# EAGLE schematic Detector (EAGLE 6.4)

## Sheet 1 of 6
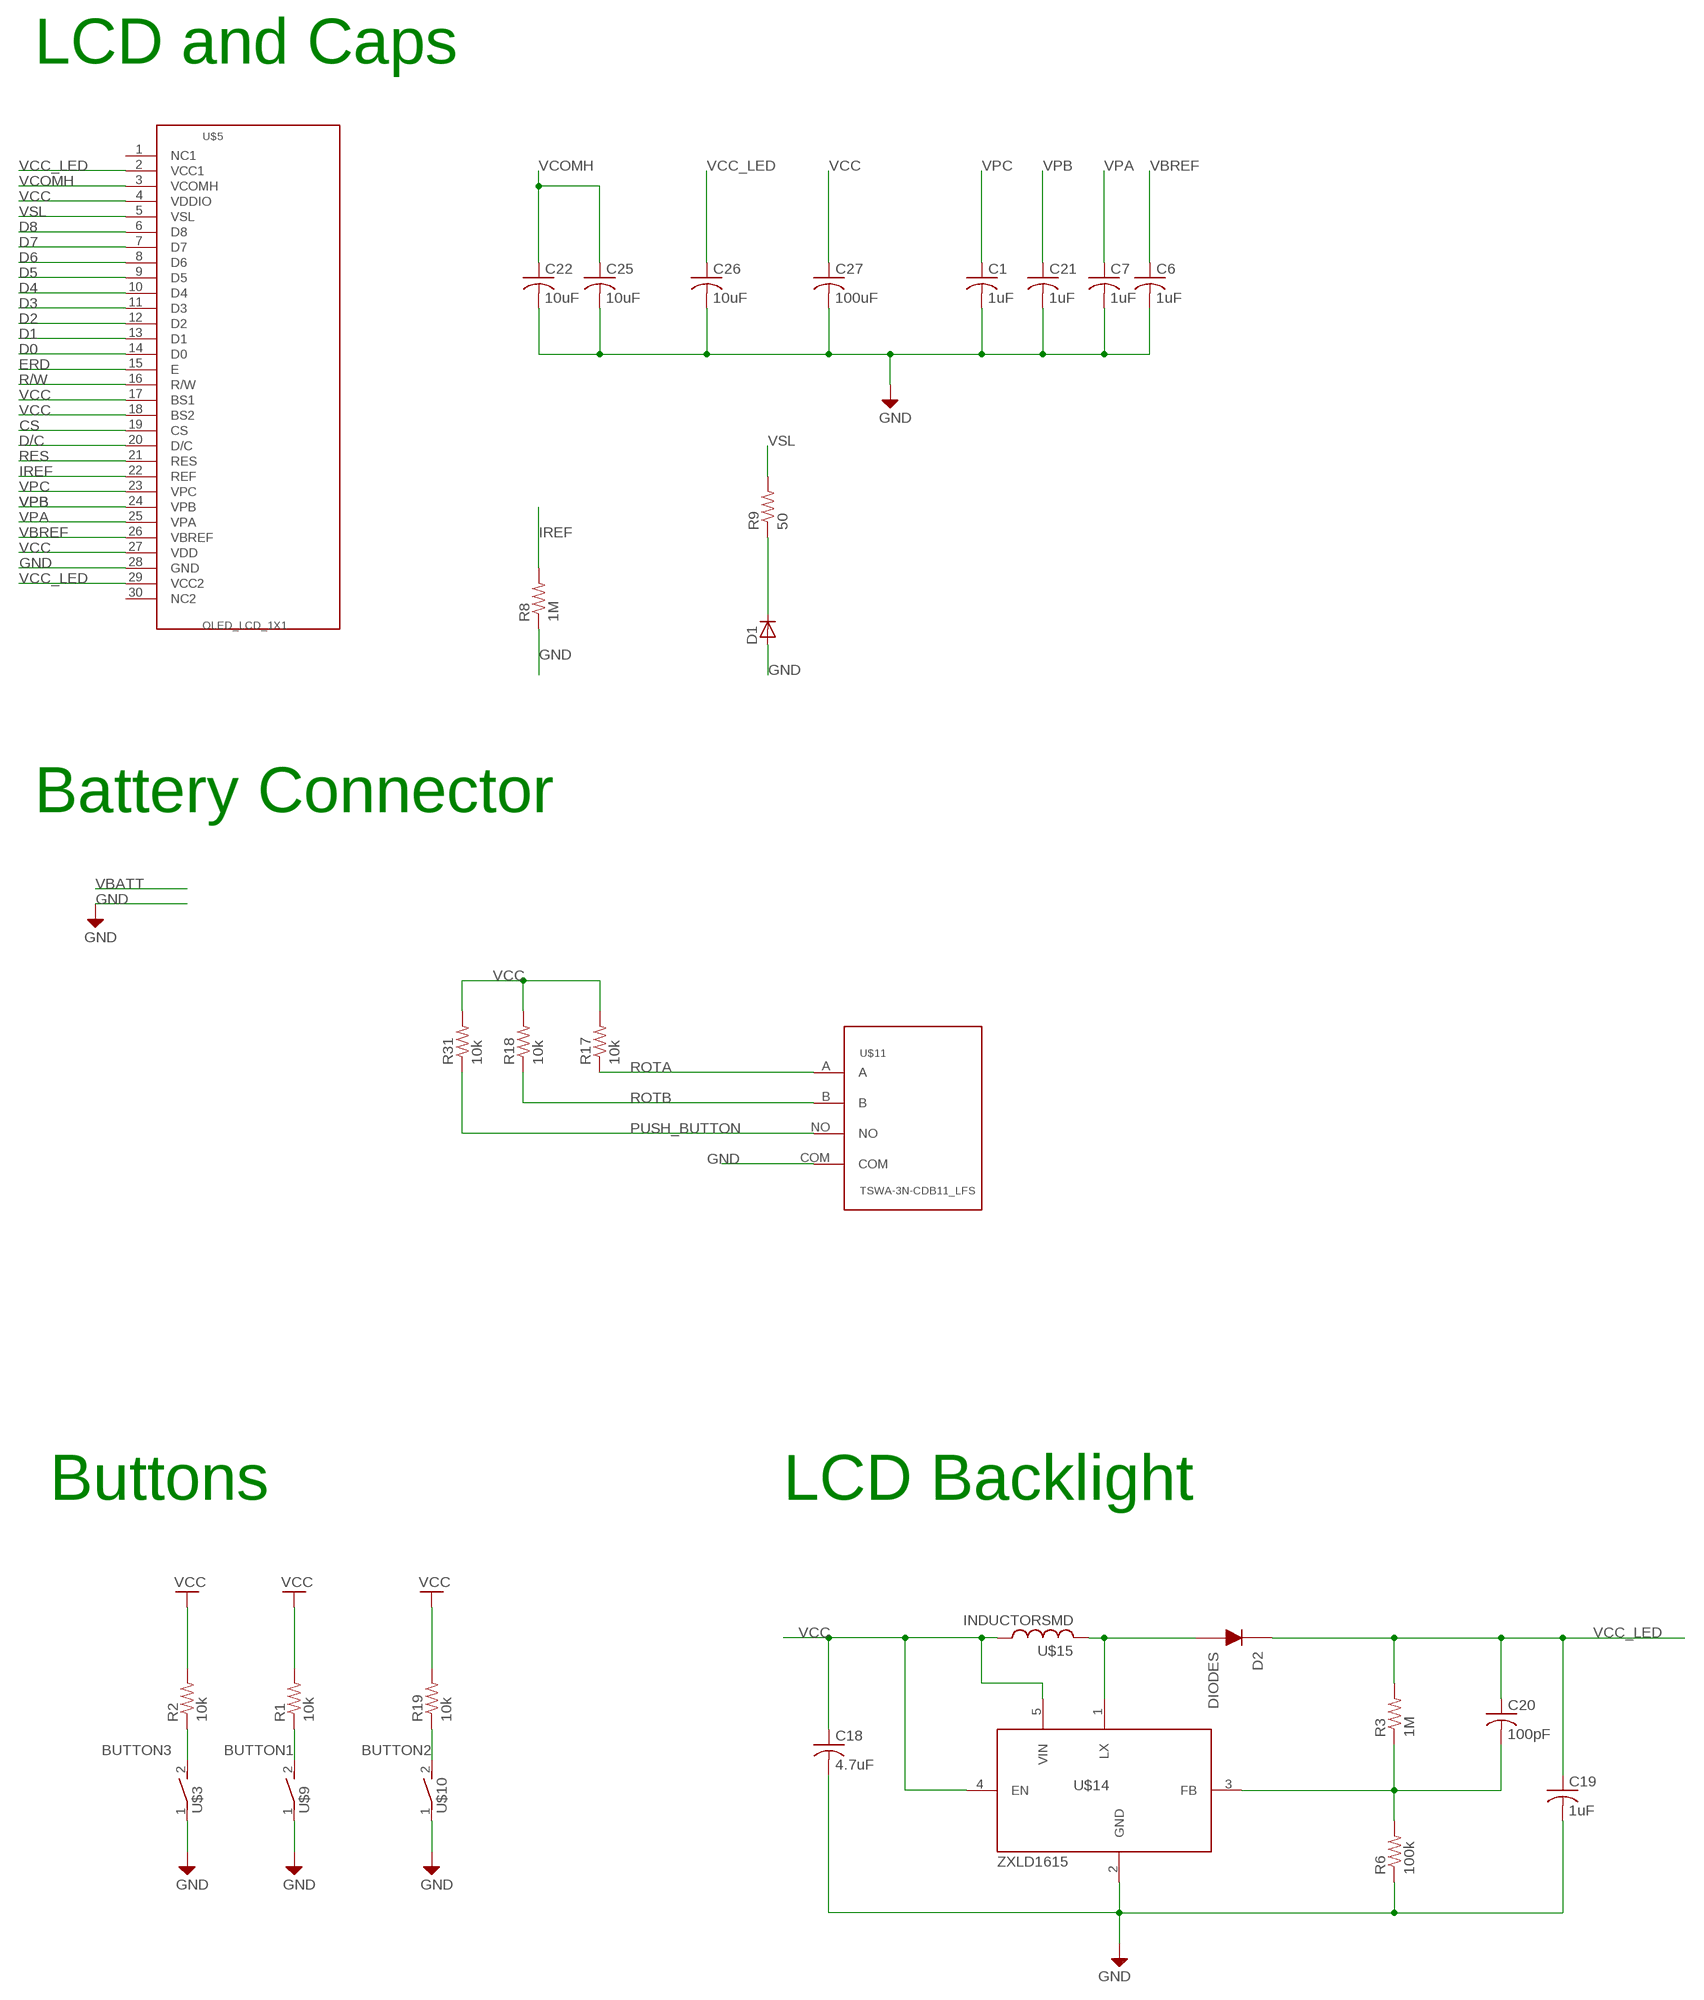
[diagram p0: schematic, sheet 1, part 1 of 2]
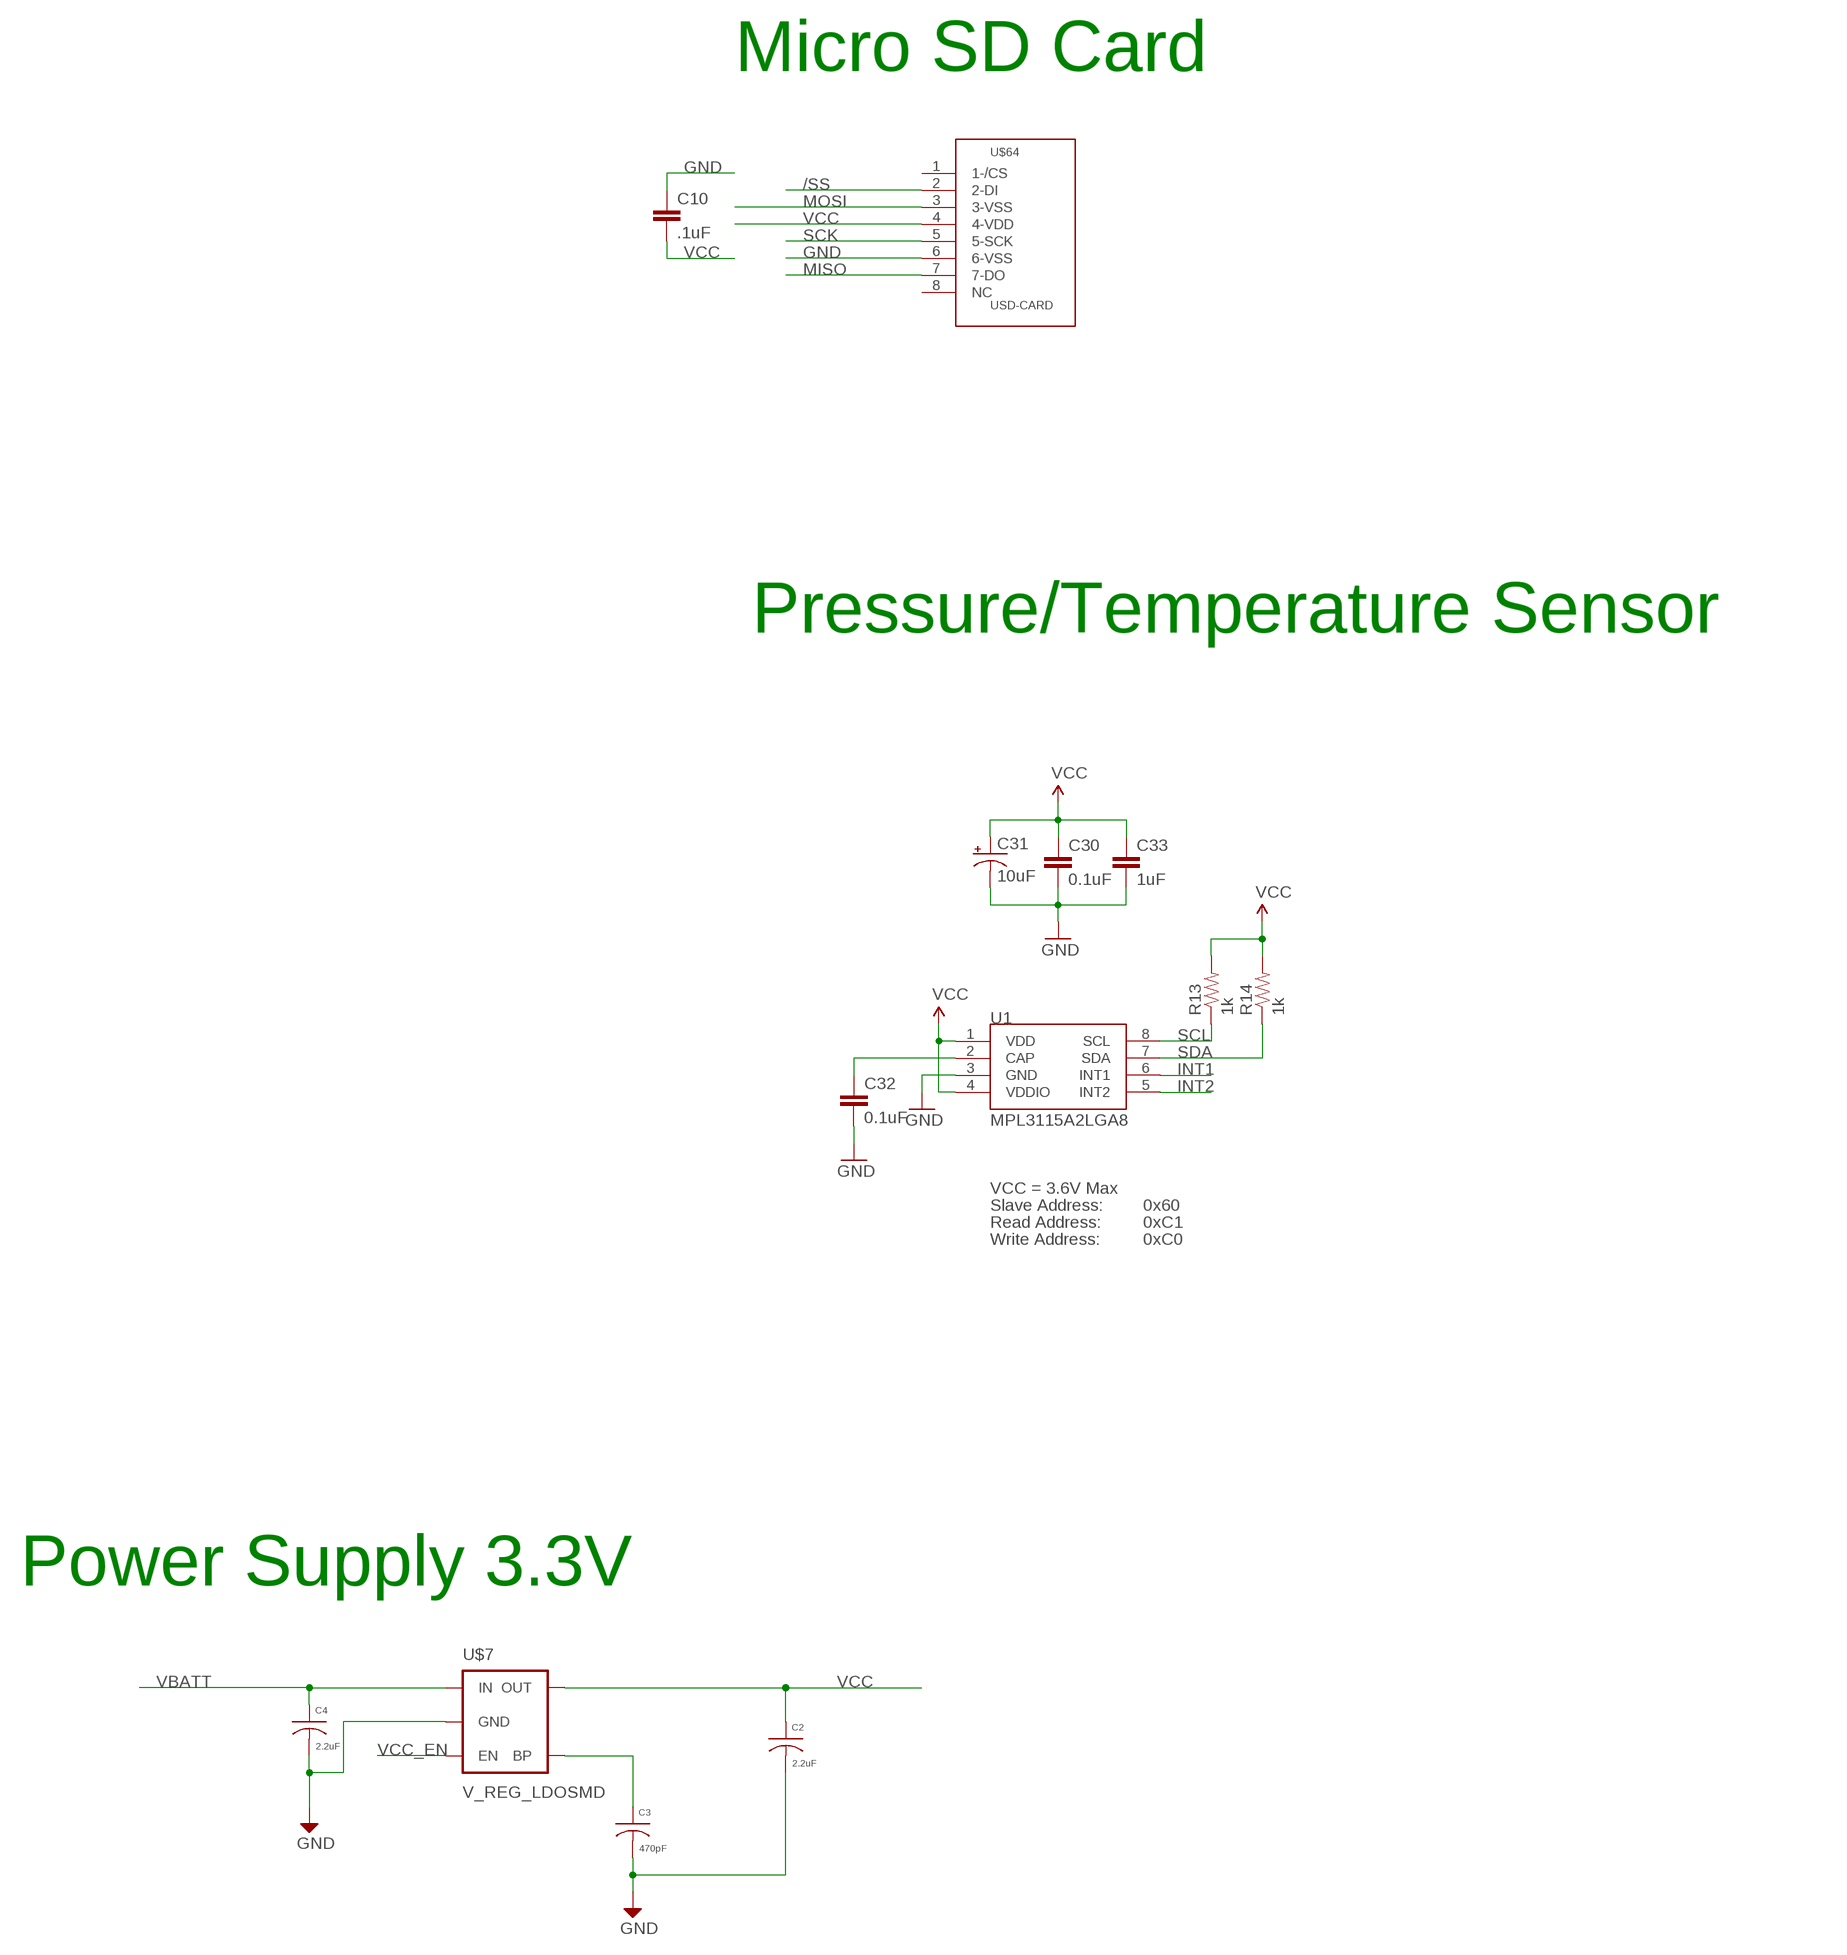
[diagram p1: schematic, sheet 1, part 2 of 2]

### Parts
C1  1uF  C-USC0603  [C0603]
C2  2.2uF  C0603  [C0603]
C3  470pF  C0603  [C0603]
C4  2.2uF  C0603  [C0603]
C6  1uF  C-USC0603  [C0603]
C7  1uF  C-USC0603  [C0603]
C10  .1uF  C-EUC0402  [C0402]
C18  4.7uF  C-USC0805K  [C0805K]
C19  1uF  C-USC1206  [C1206]
C20  100pF  C-USC0402  [C0402]
C21  1uF  C-USC0603  [C0603]
C22  10uF  C-USC0603  [C0603]
C25  10uF  C-USC0603  [C0603]
C26  10uF  C-USC0603  [C0603]
C27  100uF  C-USC0603  [C0603]
C30  0.1uF  CAP0402-CAP  [0402-CAP]
C31  10uF  CAP_POL1206  [EIA3216]
C32  0.1uF  CAP0402-CAP  [0402-CAP]
C33  1uF  CAP0402-CAP  [0402-CAP]
D1  D-SOD123  [SOD123]
D2  DIODES  [SOD-123]
R1  10k  R-US_R0603  [R0603]
R2  10k  R-US_R0603  [R0603]
R3  1M  R-US_R0805  [R0805]
R6  100k  R-US_R0805  [R0805]
R8  1M  R-US_R0603  [R0603]
R9  50  R-US_R0603  [R0603]
R13  1k  RESISTOR0402-RES  [0402-RES]
R14  1k  RESISTOR0402-RES  [0402-RES]
R17  10k  R-US_R0603  [R0603]
R18  10k  R-US_R0603  [R0603]
R19  10k  R-US_R0603  [R0603]
R31  10k  R-US_R0603  [R0603]
U1  MPL3115A2LGA8  [LGA8]
U$3  RGHT-ANGLE-SMT-SWITCH-688-SKRELF  [2.9X3.9X2.0]
U$5  OLED_LCD_1X1  [30ZIF]
U$7  V_REG_LDOSMD  [SOT23-5]
U$9  RGHT-ANGLE-SMT-SWITCH-688-SKRELF  [2.9X3.9X2.0]
U$10  RGHT-ANGLE-SMT-SWITCH-688-SKRELF  [2.9X3.9X2.0]
U$11  TSWA-3N-CDB11_LFS  [TSWA-3N-CB11_LFS]
U$14  ZXLD1615  [SOT23-5L]
U$15  INDUCTORSMD  [INDUCTORSMD1]
U$64  USD-CARD  [502774-0891]

### Nets
/SS: U$64.2(2-DI) ; also sheet 2
BUTTON1: R1.1 U$9.2 ; also sheet 2
BUTTON2: R19.1 U$10.2 ; also sheet 2
BUTTON3: R2.1 U$3.2 ; also sheet 2
CS: U$5.19(CS) ; also sheet 2
D0: U$5.14(D0) ; also sheet 2
D1: U$5.13(D1) ; also sheet 2
D2: U$5.12(D2) ; also sheet 2
D3: U$5.11(D3) ; also sheet 2
D4: U$5.10(D4) ; also sheet 2
D5: U$5.9(D5) ; also sheet 2
D6: U$5.8(D6) ; also sheet 2
D7: U$5.7(D7) ; also sheet 2
D8: U$5.6(D8) ; also sheet 2
D/C: U$5.20(D/C) ; also sheet 2
ERD: U$5.15(E) ; also sheet 2
GND: C1.2 C2.2 C3.2 C4.2 C6.2 C7.2 C10.1 C18.2 C19.2 C21.2 C22.2 C25.2 C26.2 C27.2 C30.2 C31.C(-) C32.2 C33.2 D1.2(A) R6.1 R8.1 U1.3(GND) U$3.1 U$5.28(GND) U$7.2(GND) U$9.1 U$10.1 U$11.COM U$14.2(GND) U$64.6(6-VSS) ; also sheet 2,3,4,5,6
INT1: U1.6(INT1)
INT2: U1.5(INT2)
IREF: R8.2 U$5.22(REF)
MISO: U$64.7(7-DO) ; also sheet 2
MOSI: U$64.3(3-VSS) ; also sheet 2
N$2: C3.1 U$7.4(BP)
N$3: C20.2 R3.1 R6.2 U$14.3(FB)
N$5: D1.1(C) R9.1 ; also sheet 2
N$9: D2.1(A1) U$14.1(LX) U$15.2
N$31: C32.1 U1.2(CAP)
PUSH_BUTTON: R31.1 U$11.NO ; also sheet 2
R/W: U$5.16(R/W) ; also sheet 2
RES: U$5.21(RES) ; also sheet 2
ROTA: R17.1 U$11.A ; also sheet 2
ROTB: R18.1 U$11.B ; also sheet 2
SCK: U$64.5(5-SCK) ; also sheet 2
SCL: R13.1 U1.8(SCL) ; also sheet 2,4,5
SDA: R14.1 U1.7(SDA) ; also sheet 2,4,5
VBATT: C4.1 U$7.1(IN) ; also sheet 6
VBREF: C6.1 U$5.26(VBREF)
VCC: C2.1 C10.2 C18.1 C27.1 C30.1 C31.A(+) C33.1 R1.2 R2.2 R13.2 R14.2 R17.2 R18.2 R19.2 R31.2 U1.1(VDD) U1.4(VDDIO) U$5.4(VDDIO) U$5.17(BS1) U$5.18(BS2) U$5.27(VDD) U$7.5(OUT) U$14.4(EN) U$14.5(VIN) U$15.1 U$64.4(4-VDD) ; also sheet 2,3,5
VCC_EN: U$7.3(EN)
VCC_LED: C19.1 C20.1 C26.1 D2.2(C) R3.2 U$5.2(VCC1) U$5.29(VCC2)
VCOMH: C22.1 C25.1 U$5.3(VCOMH)
VPA: C7.1 U$5.25(VPA)
VPB: C21.1 U$5.24(VPB)
VPC: C1.1 U$5.23(VPC)
VSL: R9.2 U$5.5(VSL)
Unconnected: U$5.1(NC1) U$5.30(NC2) U$64.1(1-/CS) U$64.8(NC)

### Notes on the sheet
- LCD and Caps
- Micro SD Card
- Pressure/Temperature Sensor
- Battery Connector
- VCC = 3.6V Max
- Slave Address: | 0x60
- Read Address: | 0xC1
- Write Address: | 0xC0
- Buttons | LCD Backlight | Power Supply 3.3V

## Sheet 2 of 6
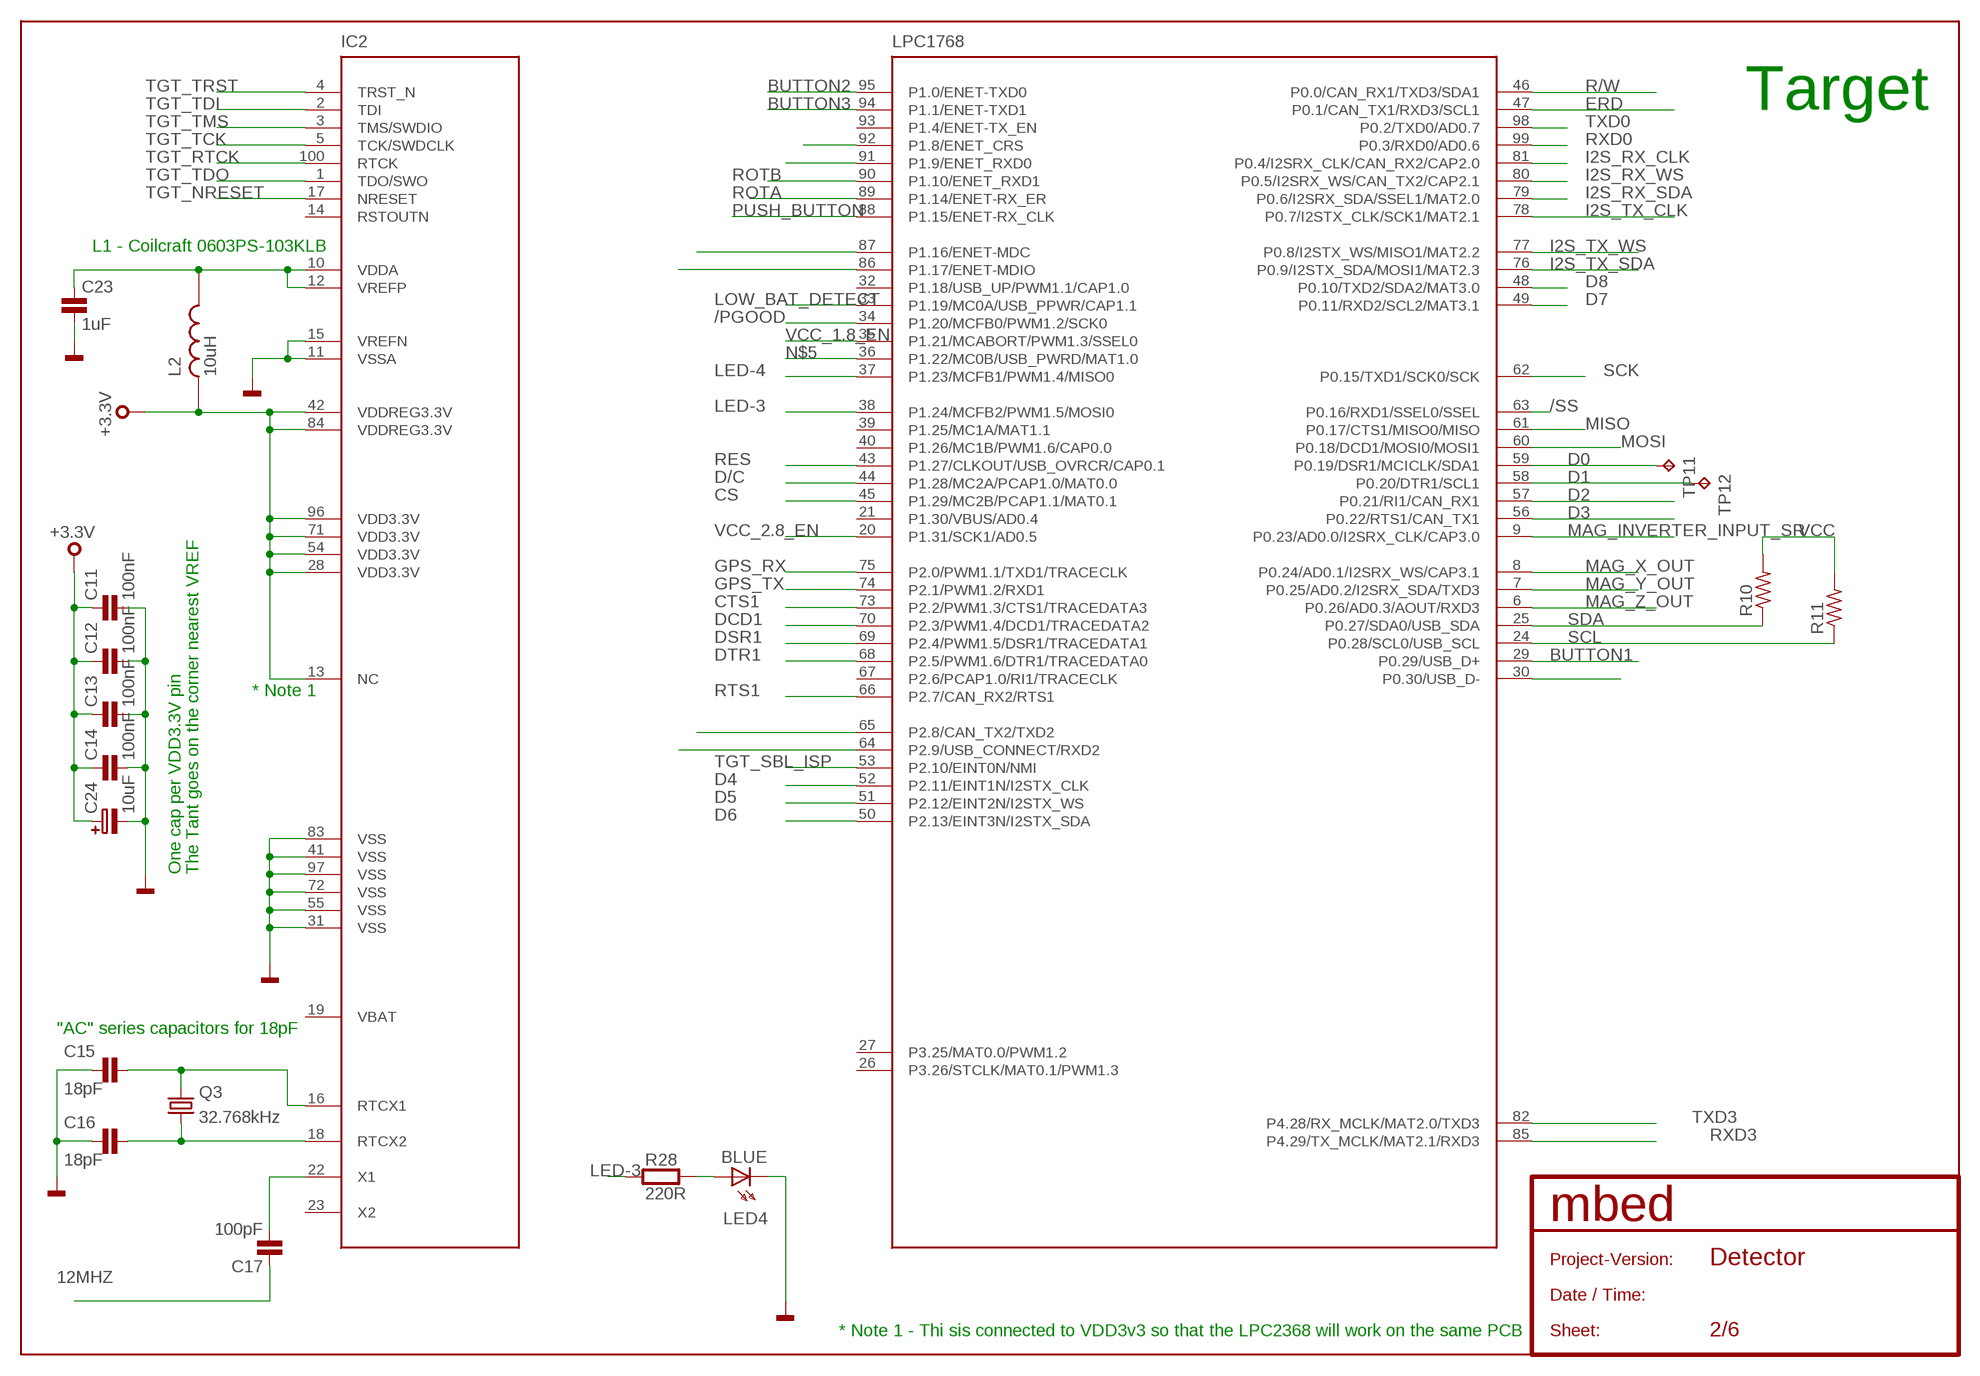
[diagram p2: schematic, sheet 2]

### Parts
C11  100nF  C0402  [0402]
C12  100nF  C0402  [0402]
C13  100nF  C0402  [0402]
C14  100nF  C0402  [0402]
C15  18pF  C0402  [0402]
C16  18pF  C0402  [0402]
C17  100pF  C0402  [0402]
C23  1uF  C0805  [0805]
C24  10uF  C-POLARISEDSMT_TANTALUM  [C106B]
IC2  LPC1768  [LQFP100]
L2  10uH  L_L  [L0603]
LED4  BLUE  LED_0805  [LED_0805]
Q3  32.768kHz  CRYSTALFC135  [FC135]
R10  R-US_R0402  [R0402]
R11  R-US_R0402  [R0402]
R28  220R  R0402  [0402]
TP11  TPTP06R  [TP06R]
TP12  TPTP06R  [TP06R]

### Nets
12MHZ: C17.1 ; also sheet 3
/PGOOD: IC2.34(P1.20/MCFB0/PWM1.2/SCK0)
/SS: IC2.63(P0.16/RXD1/SSEL0/SSEL) ; also sheet 1
BUTTON1: IC2.29(P0.29/USB_D+) ; also sheet 1
BUTTON2: IC2.95(P1.0/ENET-TXD0) ; also sheet 1
BUTTON3: IC2.94(P1.1/ENET-TXD1) ; also sheet 1
CS: IC2.45(P1.29/MC2B/PCAP1.1/MAT0.1) ; also sheet 1
CTS1: IC2.73(P2.2/PWM1.3/CTS1/TRACEDATA3)
D0: IC2.59(P0.19/DSR1/MCICLK/SDA1) TP11.TP ; also sheet 1
D1: IC2.58(P0.20/DTR1/SCL1) TP12.TP ; also sheet 1
D2: IC2.57(P0.21/RI1/CAN_RX1) ; also sheet 1
D3: IC2.56(P0.22/RTS1/CAN_TX1) ; also sheet 1
D4: IC2.52(P2.11/EINT1N/I2STX_CLK) ; also sheet 1
D5: IC2.51(P2.12/EINT2N/I2STX_WS) ; also sheet 1
D6: IC2.50(P2.13/EINT3N/I2STX_SDA) ; also sheet 1
D7: IC2.49(P0.11/RXD2/SCL2/MAT3.1) ; also sheet 1
D8: IC2.48(P0.10/TXD2/SDA2/MAT3.0) ; also sheet 1
D/C: IC2.44(P1.28/MC2A/PCAP1.0/MAT0.0) ; also sheet 1
DCD1: IC2.70(P2.3/PWM1.4/DCD1/TRACEDATA2)
DSR1: IC2.69(P2.4/PWM1.5/DSR1/TRACEDATA1)
DTR1: IC2.68(P2.5/PWM1.6/DTR1/TRACEDATA0)
ERD: IC2.47(P0.1/CAN_TX1/RXD3/SCL1) ; also sheet 1
GND: C11.2 C12.2 C13.2 C14.2 C15.1 C16.1 C23.2 C24.2 IC2.11(VSSA) IC2.15(VREFN) IC2.31(VSS) IC2.41(VSS) IC2.55(VSS) IC2.72(VSS) IC2.83(VSS) IC2.97(VSS) LED4.K ; also sheet 1,3,4,5,6
GPS_RX: IC2.75(P2.0/PWM1.1/TXD1/TRACECLK)
GPS_TX: IC2.74(P2.1/PWM1.2/RXD1)
I2S_RX_CLK: IC2.81(P0.4/I2SRX_CLK/CAN_RX2/CAP2.0) ; also sheet 4
I2S_RX_SDA: IC2.79(P0.6/I2SRX_SDA/SSEL1/MAT2.0) ; also sheet 4
I2S_RX_WS: IC2.80(P0.5/I2SRX_WS/CAN_TX2/CAP2.1) ; also sheet 4
I2S_TX_CLK: IC2.78(P0.7/I2STX_CLK/SCK1/MAT2.1) ; also sheet 4
I2S_TX_SDA: IC2.76(P0.9/I2STX_SDA/MOSI1/MAT2.3) ; also sheet 4
I2S_TX_WS: IC2.77(P0.8/I2STX_WS/MISO1/MAT2.2)
IC6_RTC1: C15.2 IC2.16(RTCX1) Q3.X2
IC6_RTC2: C16.2 IC2.18(RTCX2) Q3.X1
IC6_XTAL1: C17.2 IC2.22(X1)
LED-3: IC2.38(P1.24/MCFB2/PWM1.5/MOSI0) R28.1
LED-4: IC2.37(P1.23/MCFB1/PWM1.4/MISO0)
LOW_BAT_DETECT: IC2.33(P1.19/MC0A/USB_PPWR/CAP1.1)
MAG_INVERTER_INPUT_SR: IC2.9(P0.23/AD0.0/I2SRX_CLK/CAP3.0)
MAG_X_OUT: IC2.8(P0.24/AD0.1/I2SRX_WS/CAP3.1) ; also sheet 5
MAG_Y_OUT: IC2.7(P0.25/AD0.2/I2SRX_SDA/TXD3) ; also sheet 5
MAG_Z_OUT: IC2.6(P0.26/AD0.3/AOUT/RXD3) ; also sheet 5
MISO: IC2.61(P0.17/CTS1/MISO0/MISO) ; also sheet 1
MOSI: IC2.60(P0.18/DCD1/MOSI0/MOSI1) ; also sheet 1
N$4: IC2.30(P0.30/USB_D-)
N$5: IC2.36(P1.22/MC0B/USB_PWRD/MAT1.0) ; also sheet 1
N$18: LED4.A R28.2
N$19: C23.1 IC2.10(VDDA) IC2.12(VREFP) L2.P$2
N$20: IC2.86(P1.17/ENET-MDIO)
N$21: IC2.87(P1.16/ENET-MDC)
N$25: IC2.91(P1.9/ENET_RXD0)
N$26: IC2.92(P1.8/ENET_CRS)
N$27: IC2.65(P2.8/CAN_TX2/TXD2)
N$28: IC2.64(P2.9/USB_CONNECT/RXD2)
PUSH_BUTTON: IC2.88(P1.15/ENET-RX_CLK) ; also sheet 1
R/W: IC2.46(P0.0/CAN_RX1/TXD3/SDA1) ; also sheet 1
RES: IC2.43(P1.27/CLKOUT/USB_OVRCR/CAP0.1) ; also sheet 1
ROTA: IC2.89(P1.14/ENET-RX_ER) ; also sheet 1
ROTB: IC2.90(P1.10/ENET_RXD1) ; also sheet 1
RTS1: IC2.66(P2.7/CAN_RX2/RTS1)
RXD0: IC2.99(P0.3/RXD0/AD0.6) ; also sheet 6
RXD3: IC2.85(P4.29/TX_MCLK/MAT2.1/RXD3)
SCK: IC2.62(P0.15/TXD1/SCK0/SCK) ; also sheet 1
SCL: IC2.24(P0.28/SCL0/USB_SCL) R11.1 ; also sheet 1,4,5
SDA: IC2.25(P0.27/SDA0/USB_SDA) R10.1 ; also sheet 1,4,5
TGT_NRESET: IC2.17(NRESET) ; also sheet 3
TGT_RTCK: IC2.100(RTCK)
TGT_SBL_ISP: IC2.53(P2.10/EINT0N/NMI) ; also sheet 3
TGT_TCK: IC2.5(TCK/SWDCLK)
TGT_TDI: IC2.2(TDI)
TGT_TDO: IC2.1(TDO/SWO)
TGT_TMS: IC2.3(TMS/SWDIO)
TGT_TRST: IC2.4(TRST_N)
TXD0: IC2.98(P0.2/TXD0/AD0.7) ; also sheet 6
TXD3: IC2.82(P4.28/RX_MCLK/MAT2.0/TXD3)
VCC: C11.1 C12.1 C13.1 C14.1 C24.1 IC2.13(NC) IC2.28(VDD3.3V) IC2.42(VDDREG3.3V) IC2.54(VDD3.3V) IC2.71(VDD3.3V) IC2.84(VDDREG3.3V) IC2.96(VDD3.3V) L2.P$1 R10.2 R11.2 ; supply symbol labelled +3.3V ; also sheet 1,3,5
VCC_1.8_EN: IC2.35(P1.21/MCABORT/PWM1.3/SSEL0)
VCC_2.8_EN: IC2.20(P1.31/SCK1/AD0.5)
Unconnected: IC2.14(RSTOUTN) IC2.19(VBAT) IC2.21(P1.30/VBUS/AD0.4) IC2.23(X2) IC2.26(P3.26/STCLK/MAT0.1/PWM1.3) IC2.27(P3.25/MAT0.0/PWM1.2) IC2.32(P1.18/USB_UP/PWM1.1/CAP1.0) IC2.39(P1.25/MC1A/MAT1.1) IC2.40(P1.26/MC1B/PWM1.6/CAP0.0) IC2.67(P2.6/PCAP1.0/RI1/TRACECLK) IC2.93(P1.4/ENET-TX_EN)

### Notes on the sheet
- Target
- L1 - Coilcraft 0603PS-103KLB
- * Note 1
- One cap per VDD3.3V pin | The Tant goes on the corner nearest VREF
- "AC" series capacitors for 18pF
- * Note 1 - Thi sis connected to VDD3v3 so that the LPC2368 will work on the same PCB

## Sheet 3 of 6
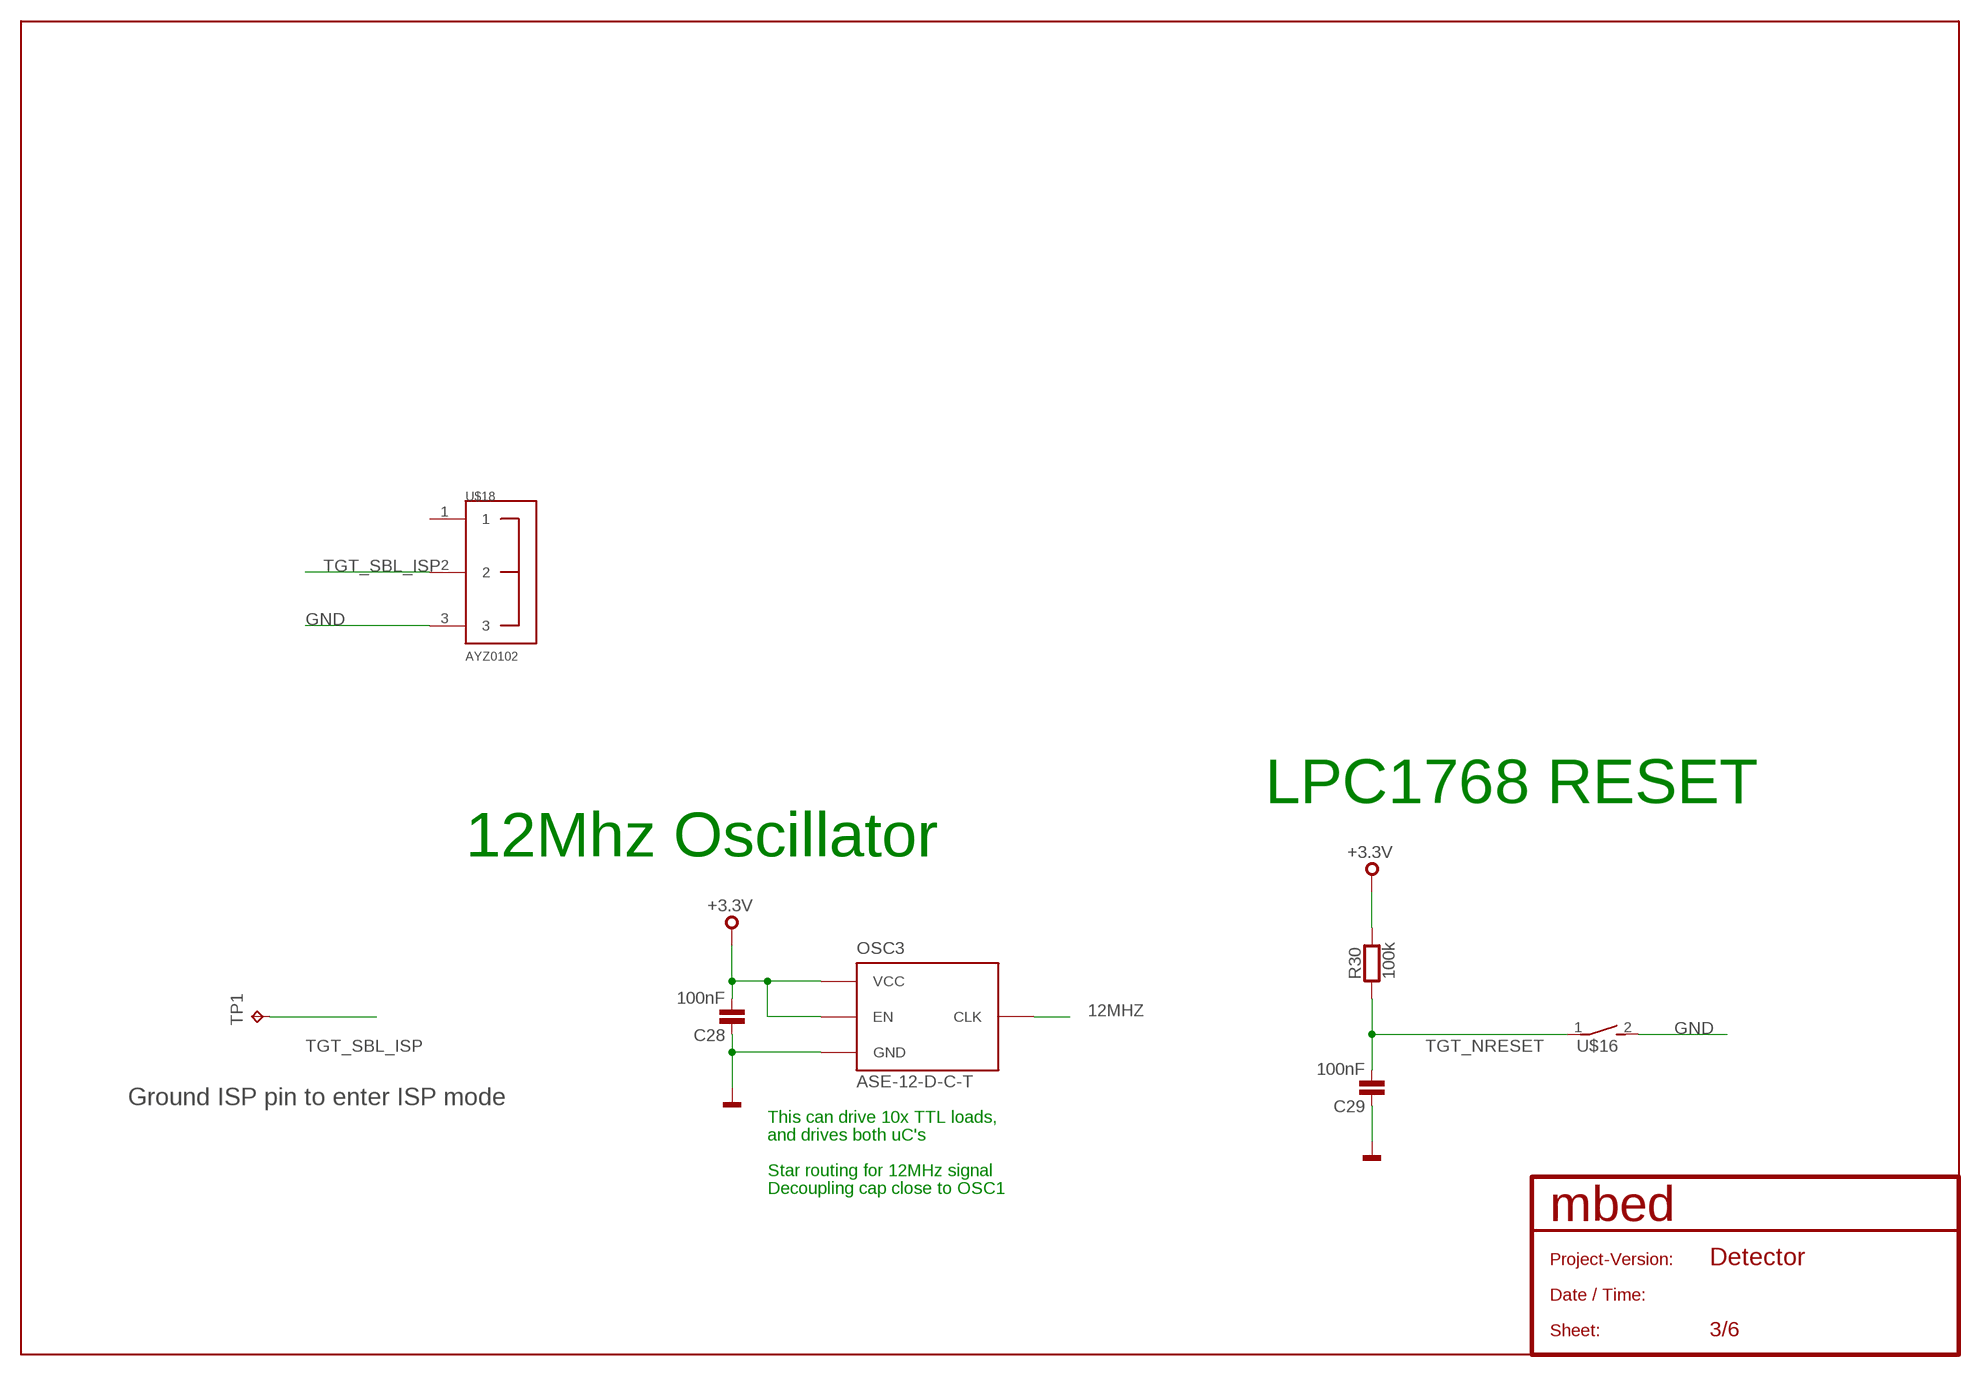
[diagram p3: schematic, sheet 3]

### Parts
C28  100nF  C0402  [0402]
C29  100nF  C0402  [0402]
OSC3  ASE-12-D-C-T  OSCILLATOR_2.5X3.2  [OSC3.2X.2.5]
R30  100k  R0402  [0402]
TP1  TPTP09R  [TP09R]
U$16  RGHT-ANGLE-SMT-SWITCH-688-SKRELF  [2.9X3.9X2.0]
U$18  AYZ0102  [AYZ0102]

### Nets
12MHZ: OSC3.P$3(CLK) ; also sheet 2
GND: C28.1 C29.1 OSC3.P$2(GND) U$16.2 U$18.3 ; also sheet 1,2,4,5,6
TGT_NRESET: C29.2 R30.1 U$16.1 ; also sheet 2
TGT_SBL_ISP: TP1.TP U$18.2 ; also sheet 2
VCC: C28.2 OSC3.P$1(EN) OSC3.P$4(VCC) R30.2 ; supply symbol labelled +3.3V ; also sheet 1,2,5
Unconnected: U$18.1

### Notes on the sheet
- LPC1768 RESET
- 12Mhz Oscillator
- Ground ISP pin to enter ISP mode
- This can drive 10x TTL loads,
- and drives both uC's
- Star routing for 12MHz signal
- Decoupling cap close to OSC1

## Sheet 4 of 6
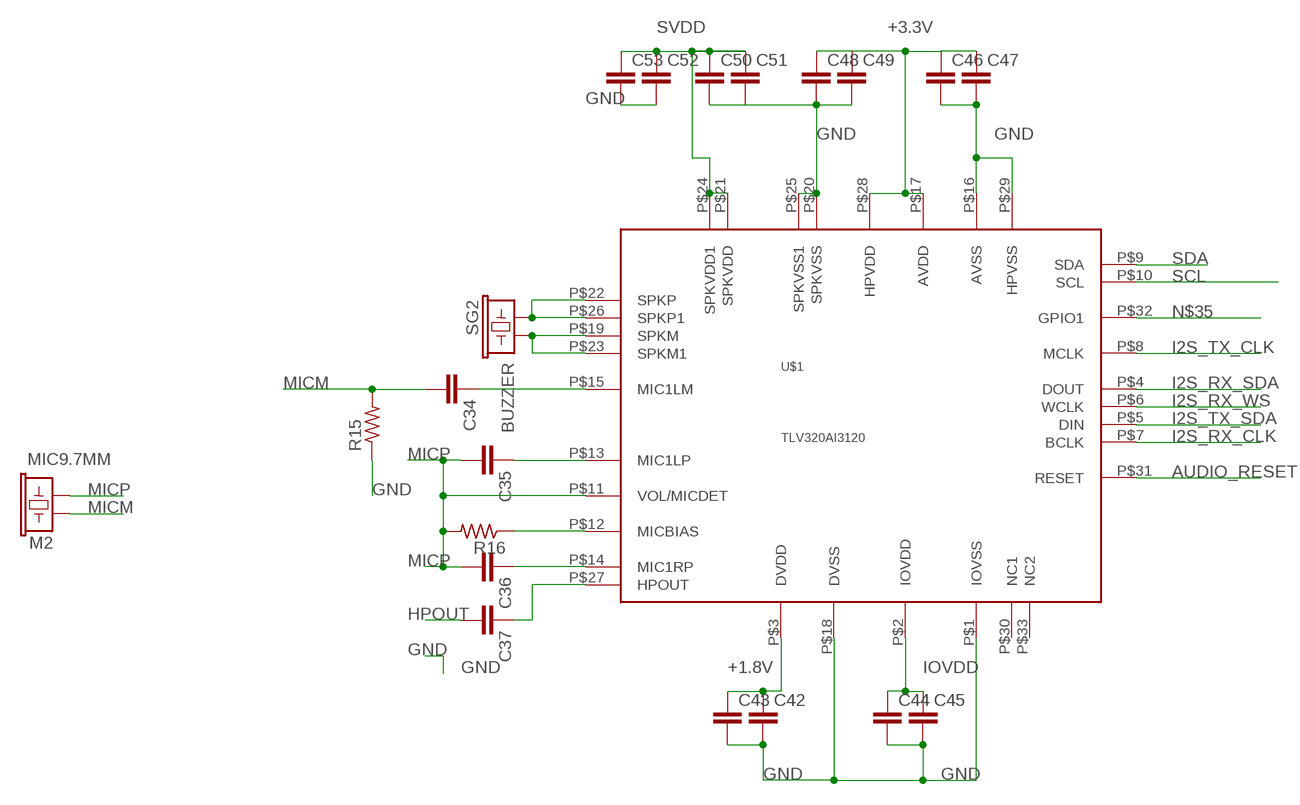
[diagram p4: schematic, sheet 4]

### Parts
C34  C-EUC0402  [C0402]
C35  C-EUC0402  [C0402]
C36  C-EUC0402  [C0402]
C37  C-EUC0402  [C0402]
C42  C-EUC0402  [C0402]
C43  C-EUC0402  [C0402]
C44  C-EUC0402  [C0402]
C45  C-EUC0402  [C0402]
C46  C-EUC0402  [C0402]
C47  C-EUC0402  [C0402]
C48  C-EUC0402  [C0402]
C49  C-EUC0402  [C0402]
C50  C-EUC0402  [C0402]
C51  C-EUC0402  [C0402]
C52  C-EUC0402  [C0402]
C53  C-EUC0402  [C0402]
M2  MIC9.7MM  [MIC-9.7MM]
R15  R-US_R0402  [R0402]
R16  R-US_R0402  [R0402]
SG2  BUZZER  [SMS-1308]
U$1  TLV320AI3120  [QFN-32]

### Nets
+1.8V: C42.1 C43.1 U$1.P$3(DVDD)
+3.3V: C46.1 C47.1 C48.1 C49.1 U$1.P$17(AVDD) U$1.P$28(HPVDD)
AUDIO_RESET: U$1.P$31(RESET)
GND: C42.2 C43.2 C44.2 C45.2 C46.2 C47.2 C48.2 C49.2 C50.2 C51.2 C52.2 C53.2 R15.1 U$1.P$1(IOVSS) U$1.P$16(AVSS) U$1.P$18(DVSS) U$1.P$20(SPKVSS) U$1.P$25(SPKVSS1) U$1.P$29(HPVSS) ; also sheet 1,2,3,5,6
HPOUT: C37.2
I2S_RX_CLK: U$1.P$7(BCLK) ; also sheet 2
I2S_RX_SDA: U$1.P$4(DOUT) ; also sheet 2
I2S_RX_WS: U$1.P$6(WCLK) ; also sheet 2
I2S_TX_CLK: U$1.P$8(MCLK) ; also sheet 2
I2S_TX_SDA: U$1.P$5(DIN) ; also sheet 2
IOVDD: C44.1 C45.1 U$1.P$2(IOVDD)
MICM: C34.2 M2.2 R15.2
MICP: C35.2 C36.2 M2.1 R16.2 U$1.P$11(VOL/MICDET)
N$12: SG2.+ U$1.P$22(SPKP) U$1.P$26(SPKP1)
N$17: SG2.- U$1.P$19(SPKM) U$1.P$23(SPKM1)
N$32: C34.1 U$1.P$15(MIC1LM)
N$35: U$1.P$32(GPIO1)
N$36: R16.1 U$1.P$12(MICBIAS)
N$37: C35.1 U$1.P$13(MIC1LP)
N$38: C36.1 U$1.P$14(MIC1RP)
N$39: C37.1 U$1.P$27(HPOUT)
SCL: U$1.P$10(SCL) ; also sheet 1,2,5
SDA: U$1.P$9(SDA) ; also sheet 1,2,5
SVDD: C50.1 C51.1 C52.1 C53.1 U$1.P$21(SPKVDD) U$1.P$24(SPKVDD1)
Unconnected: U$1.P$30(NC1) U$1.P$33(NC2)

## Sheet 5 of 6
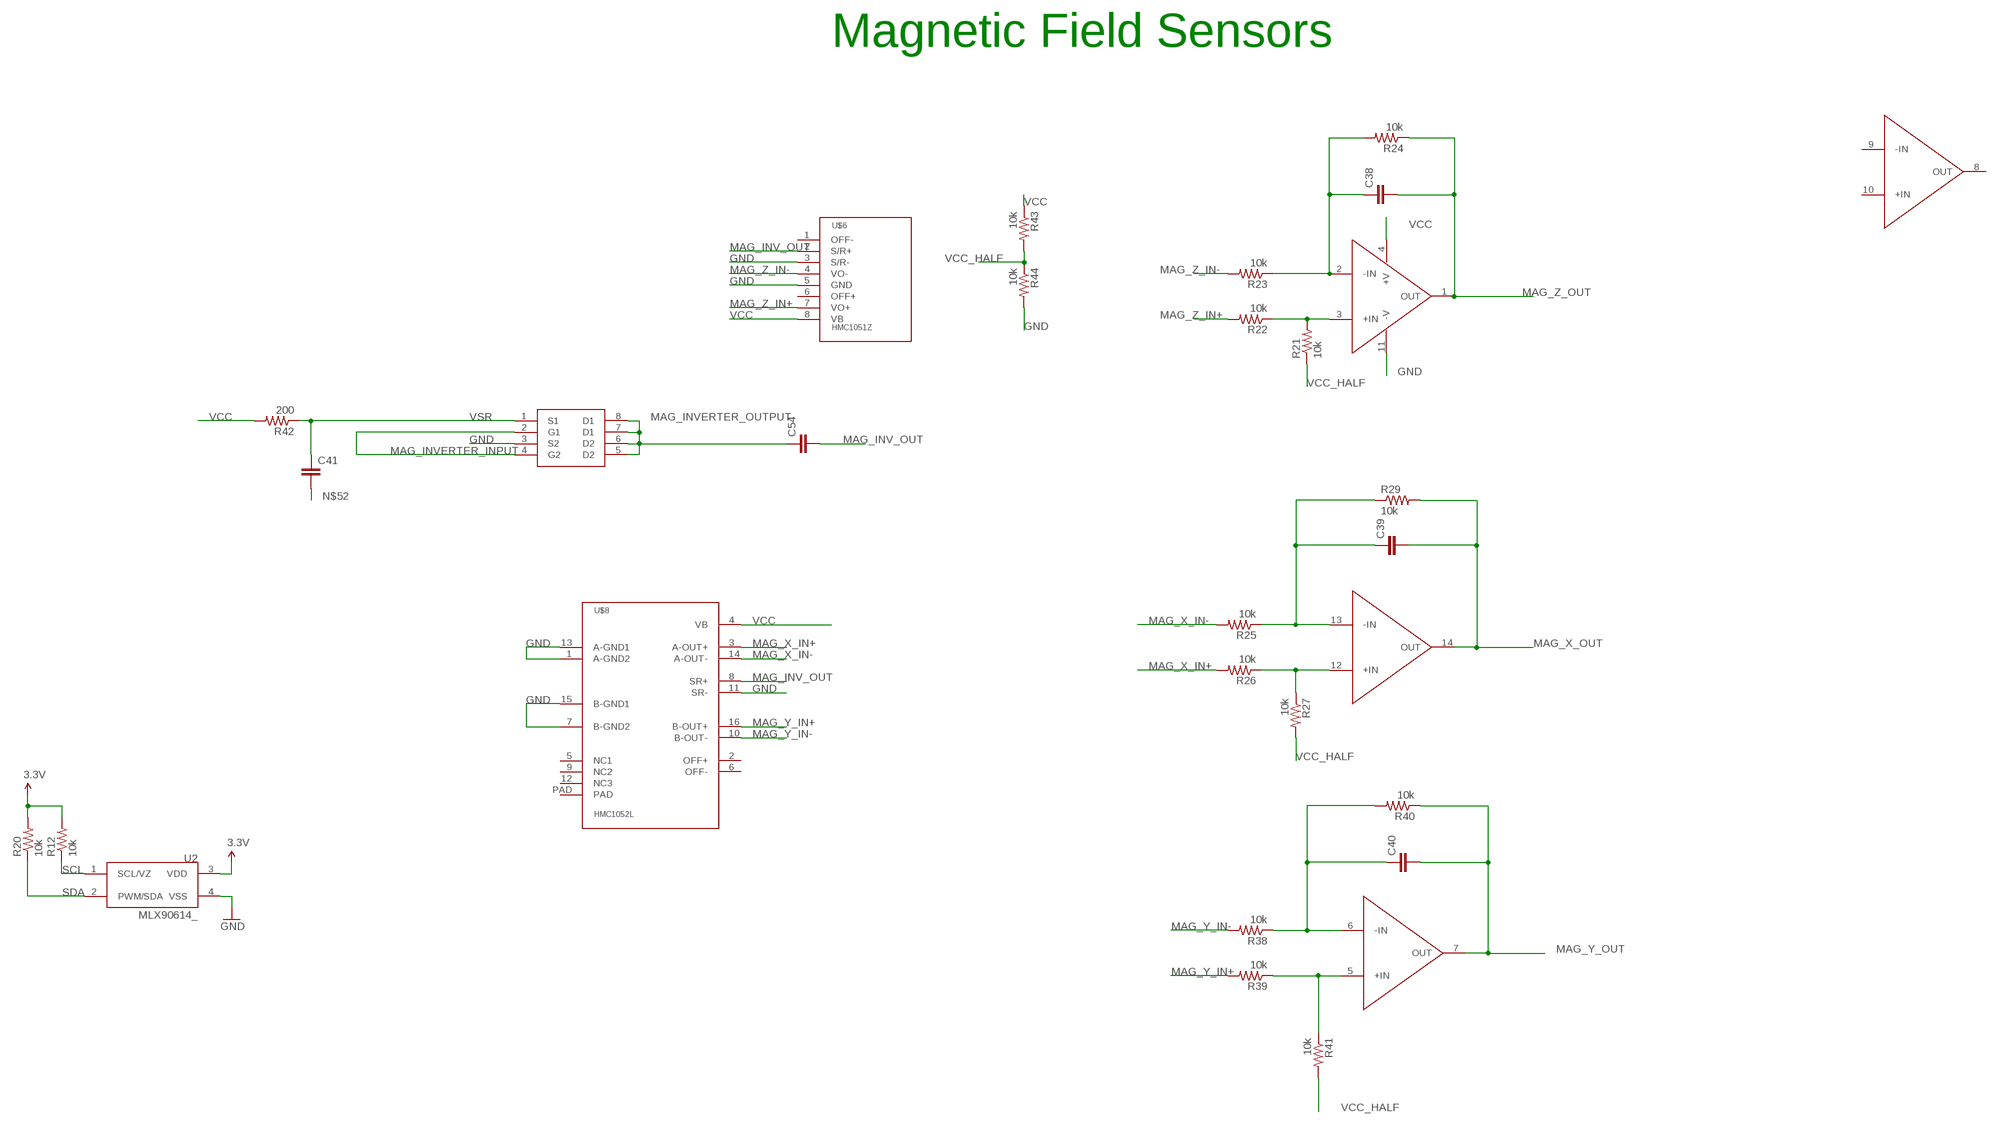
[diagram p5: schematic, sheet 5]

### Parts
C38  C-EUC0402  [C0402]
C39  C-EUC0402  [C0402]
C40  C-EUC0402  [C0402]
C41  C-EUC0402  [C0402]
C54  C-EUC0402  [C0402]
R12  10k  RESISTOR0402-RES  [0402-RES]
R20  10k  RESISTOR0402-RES  [0402-RES]
R21  10k  RESISTOR0402-RES  [0402-RES]
R22  10k  RESISTOR0402-RES  [0402-RES]
R23  10k  RESISTOR0402-RES  [0402-RES]
R24  10k  RESISTOR0402-RES  [0402-RES]
R25  10k  RESISTOR0402-RES  [0402-RES]
R26  10k  RESISTOR0402-RES  [0402-RES]
R27  10k  RESISTOR0402-RES  [0402-RES]
R29  10k  RESISTOR0402-RES  [0402-RES]
R38  10k  RESISTOR0402-RES  [0402-RES]
R39  10k  RESISTOR0402-RES  [0402-RES]
R40  10k  RESISTOR0402-RES  [0402-RES]
R41  10k  RESISTOR0402-RES  [0402-RES]
R42  200  RESISTOR0402-RES  [0402-RES]
R43  10k  RESISTOR0402-RES  [0402-RES]
R44  10k  RESISTOR0402-RES  [0402-RES]
U2  MLX90614_  [TO-39]
U$6  HMC1051Z  [HMC-SIP]
U$8  HMC1052L  [LCC-16]
U$12  LMV324  [SO014]
U$13  IRF7507  [MSOP8]

### Nets
3.3V: R12.2 R20.2 U2.3(VDD)
GND: R44.2 U2.4(VSS) U$6.3(S/R-) U$6.5(GND) U$8.1(A-GND2) U$8.7(B-GND2) U$8.11(SR-) U$8.13(A-GND1) U$8.15(B-GND1) U$12.11(-V) U$13.3(S2) ; also sheet 1,2,3,4,6
MAG_INV_OUT: C54.2 U$6.2(S/R+) U$8.8(SR+)
MAG_INVERTER_INPUT: U$13.2(G1) U$13.4(G2)
MAG_INVERTER_OUTPUT: C54.1 U$13.5(D2) U$13.6(D2) U$13.7(D1) U$13.8(D1)
MAG_X_IN+: R26.2 U$8.3(A-OUT+)
MAG_X_IN-: R25.2 U$8.14(A-OUT-)
MAG_X_OUT: C39.2 R29.2 U$12.14(OUT) ; also sheet 2
MAG_Y_IN+: R39.2 U$8.16(B-OUT+)
MAG_Y_IN-: R38.2 U$8.10(B-OUT-)
MAG_Y_OUT: C40.2 R40.1 U$12.7(OUT) ; also sheet 2
MAG_Z_IN+: R22.2 U$6.7(VO+)
MAG_Z_IN-: R23.2 U$6.4(VO-)
MAG_Z_OUT: C38.2 R24.1 U$12.1(OUT) ; also sheet 2
N$7: C38.1 R23.1 R24.2 U$12.2(-IN)
N$10: R21.2 R22.1 U$12.3(+IN)
N$50: C39.1 R25.1 R29.1 U$12.13(-IN)
N$51: R26.1 R27.1 U$12.12(+IN)
N$52: C41.2
N$56: C40.1 R38.1 R40.2 U$12.6(-IN)
N$60: R39.1 R41.1 U$12.5(+IN)
SCL: R12.1 U2.1(SCL/VZ) ; also sheet 1,2,4
SDA: R20.1 U2.2(PWM/SDA) ; also sheet 1,2,4
VCC: R42.2 R43.1 U$6.8(VB) U$8.4(VB) U$12.4(+V) ; also sheet 1,2,3
VCC_HALF: R21.1 R27.2 R41.2 R43.2 R44.1
VSR: C41.1 R42.1 U$13.1(S1)
Unconnected: U$6.1(OFF-) U$6.6(OFF+) U$8.2(OFF+) U$8.5(NC1) U$8.6(OFF-) U$8.9(NC2) U$8.12(NC3) U$8.PAD

### Notes on the sheet
- Magnetic Field Sensors

## Sheet 6 of 6
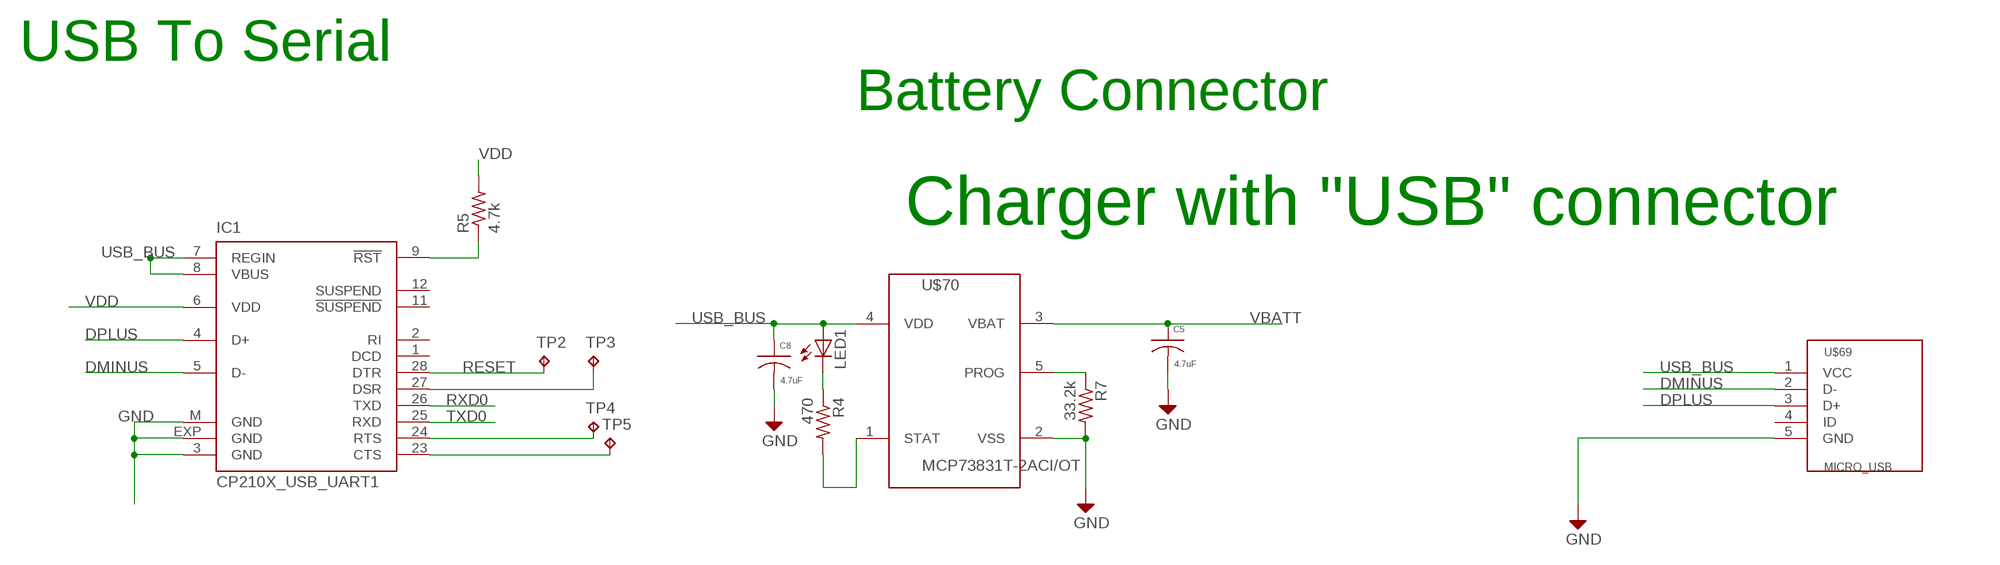
[diagram p6: schematic, sheet 6]

### Parts
C5  4.7uF  C0603  [C0603]
C8  4.7uF  C0603  [C0603]
IC1  CP210X_USB_UART1  [MLP28]
LED1  LEDCHIP-LED0603  [CHIP-LED0603]
R4  470  R-US_R0402  [R0402]
R5  4.7k  R-US_R0402  [R0402]
R7  33.2k  R-US_R0402  [R0402]
TP2  TPTP06R  [TP06R]
TP3  TPTP06R  [TP06R]
TP4  TPTP06R  [TP06R]
TP5  TPTP06R  [TP06R]
U$69  MICRO_USB  [MICRO_USB]
U$70  MCP73831T-2ACI/OT  [SOT23-5L]

### Nets
CHG_STAT: R4.2 U$70.1(STAT)
DMINUS: IC1.5(D-) U$69.2(D-)
DPLUS: IC1.4(D+) U$69.3(D+)
GND: C5.2 C8.2 IC1.3(GND) IC1.EXP(GND) IC1.M(GND) R7.2 U$69.5(GND) U$70.2(VSS) ; also sheet 1,2,3,4,5
N$1: IC1.9(!RST) R5.1
N$8: IC1.24(RTS) TP4.TP
N$11: IC1.23(CTS) TP5.TP
N$13: IC1.27(DSR) TP3.TP
N$40: LED1.C R4.1
N$41: R7.1 U$70.5(PROG)
RESET: IC1.28(DTR) TP2.TP
RXD0: IC1.26(TXD) ; also sheet 2
TXD0: IC1.25(RXD) ; also sheet 2
USB_BUS: C8.1 IC1.7(REGIN) IC1.8(VBUS) LED1.A U$69.1(VCC) U$70.4(VDD)
VBATT: C5.1 U$70.3(VBAT) ; also sheet 1
VDD: IC1.6(VDD) R5.2
Unconnected: IC1.1(DCD) IC1.2(RI) IC1.11(!SUSPEND) IC1.12(SUSPEND) U$69.4(ID)

### Notes on the sheet
- USB To Serial
- Battery Connector
- Charger with "USB" connector

## Power pins joined to a net without a drawn wire
+IN: U$12.10(+IN)
-IN: U$12.9(-IN)
OUT: U$12.8(OUT)

## Library data of the parts
C1 C6 C7 C18-C22 C25-C27 = rcl:C-US: CAPACITOR, American symbol
C2-C5 C8 = qualified_1:C
C10 C34-C54 = rcl:C-EU: CAPACITOR, European symbol
C11-C17 C23 C28 C29 = mbed:C
C24 = mbed:C-POLARISED
C30 C32 C33 = SparkFun:CAP: Capacitor Standard 0603 ceramic capacitor, and 0.1" leaded capacitor.
C31 = SparkFun:CAP_POL: Capacitor Polarized These are standard SMD and PTH capacitors. Normally 10uF, 47uF, and 100uF in electrolytic and tantalum varieties. Always verify the external diameter of the through hole cap, it varies with capacity, voltage, and manufacturer. The EIA devices should be standard.
D1 = semicon-smd-ipc:D-: DIODE unfilled
D2 = m-pad-2.0:DIODES: Various Diodes: Diodes Inc BAS16/MMBD4148/MMBD914 SURFACE MOUNT SWITCHING DIODE Features: Fast Switching Speed Surface Mount Package Ideally Suited for Automatic Insertion For General Purpose Switching Applications High Conductance Available in Lead Free/RoHS Compliant Version (Note 3) Qualified to AEC-Q101 Standards for High Reliability Central Semiconductor's CMSD4448 SURFACE MOUNT SUPERmini HIGH SPEED SILICON SWITCHING DIODE DESCRIPTION: The CENTRAL SEMICONDUCTOR CMSD4448 type is a ultra-high speed silicon switching diode manufactured by the epitaxial planar process, in an epoxy molded SUPERminiTM surface mount package, designed for high switching applications. MARKING CODE: ADA
IC1 = SparkFun-3-2-07:CP210X_USB_UART: Single-Chip USB to UART Bridge Source: www.silabs.com .. CP2101.pdf / cp2102.pdf. Spark Fun Electronics SKU : IC-CP2102
IC2 = mbed:LPC1768
L2 = mbed:L
LED1 = led:LED: LED OSRAM: - CHIPLED LG R971, LG N971, LY N971, LG Q971, LY Q971, LO R971, LY R971 LH N974, LH R974 LS Q976, LO Q976, LY Q976 LO Q996 - Hyper CHIPLED LW Q18S LB Q993, LB Q99A, LB R99A - SideLED LS A670, LO A670, LY A670, LG A670, LP A670 LB A673, LV A673, LT A673, LW A673 LH A674 LY A675 LS A676, LA A676, LO A676, LY A676, LW A676 LS A679, LY A679, LG A679 - Hyper Micro SIDELED® LS Y876, LA Y876, LO Y876, LY Y876 LT Y87S - SmartLED LW L88C, LW L88S LB L89C, LB L89S, LG L890 LS L89K, LO L89K, LY L89K LS L896, LA L896, LO L896, LY L896 - TOPLED LS T670, LO T670, LY T670, LG T670, LP T670 LSG T670, LSP T670, LSY T670, LOP T670, LYG T670 LG T671, LOG T671, LSG T671 LB T673, LV T673, LT T673, LW T673 LH T674 LS T676, LA T676, LO T676, LY T676, LB T676, LH T676, LSB T676, LW T676 LB T67C, LV T67C, LT T67C, LS T67K, LO T67K, LY T67K, LW E67C LS E67B, LA E67B, LO E67B, LY E67B, LB E67C, LV E67C, LT E67C LW T67C LS T679, LY T679, LG T679 LS T770, LO T770, LY T770, LG T770, LP T770 LB T773, LV T773, LT T773, LW T773 LH T774 LS E675, LA E675, LY E675, LS T675 LS T776, LA T776, LO T776, LY T776, LB T776 LHGB T686 LT T68C, LB T68C - Hyper Mini TOPLED® LB M676 - Mini TOPLED Santana® LG M470 LS M47K, LO M47K, LY M47K Source: http://www.osram.convergy.de LUXEON: - LUMILED® LXK2-PW12-R00, LXK2-PW12-S00, LXK2-PW14-U00, LXK2-PW14-V00 LXK2-PM12-R00, LXK2-PM12-S00, LXK2-PM14-U00 LXK2-PE12-Q00, LXK2-PE12-R00, LXK2-PE12-S00, LXK2-PE14-T00, LXK2-PE14-U00 LXK2-PB12-K00, LXK2-PB12-L00, LXK2-PB12-M00, LXK2-PB14-N00, LXK2-PB14-P00, LXK2-PB14-Q00 LXK2-PR12-L00, LXK2-PR12-M00, LXK2-PR14-Q00, LXK2-PR14-R00 LXK2-PD12-Q00, LXK2-PD12-R00, LXK2-PD12-S00 LXK2-PH12-R00, LXK2-PH12-S00 LXK2-PL12-P00, LXK2-PL12-Q00, LXK2-PL12-R00 Source: www.luxeon.com KINGBRIGHT: KA-3528ASYC Source: www.kingbright.com
LED4 = mbed:LED
M2 = SparkFun:MIC: Microphone Omni-directional electret microphone. 9.7mm standard diameter.
OSC3 = mbed:OSCILLATOR
Q3 = LPC1768RefDesign:CRYSTAL: CRYSTAL
R1-R11 R15-R19 R31 = rcl:R-US_: RESISTOR, American symbol
R12-R14 R20-R27 R29 R38-R44 = SparkFun:RESISTOR: Resistor Basic schematic elements and footprints for 0603, 1206, and PTH 1/10th watt (small) resistors.
R28 R30 = mbed:R
SG2 = SparkFun:BUZZER: Buzzer 12mm Spark Fun Electronics SKU : Comp-Buzzer
TP1-TP5 TP11 TP12 = testpad:TP: Test pad
U1 = SparkFun-Sensors:MPL3115A2: Altimeter/Pressure Sensor, I2C, 1.95V-3.6V supply, 50 to 110kPa
U2 = SparkFun:MLX90614: Melexis IR Thermometer
U$1 = m-pad-2.1:TLV320AI3120
U$3 U$9 U$10 U$16 = m-pad-2.0:RGHT-ANGLE-SMT-SWITCH-688-SKRELF
U$5 = m-pad-2.0:OLED_LCD_1X1
U$6 = m-pad-2.1:HMC1051Z
U$7 = SparkFun-3-2-07:V_REG_LDO: Voltage Regulator LDO Standard 150mA LDO voltage regulator in SOT-23 layout. Micrel part MIC5205. BP (by-pass) pin is used to lower output noise with 470pF cap.
U$8 = m-pad-2.1:HMC1052L
U$11 = m-pad-2.1:TSWA-3N-CDB11_LFS
U$12 = SparkFun:LMV324
U$13 = SparkFun:IRF7507
U$14 = m-pad-2.0:ZXLD1615
U$15 = m-pad-2.0:INDUCTORSMD
U$18 = SparkFun-3-2-07:AYZ0102
U$64 = m-pad-2.1:USD-CARD
U$69 = camera_project:MICRO_USB
U$70 = m-pad-2.1:MCP73831T-2ACI/OT

## Net classes
3 battery: width 0.229 mm